# Altium schematic sheet Sheet1.SchDoc
size A2
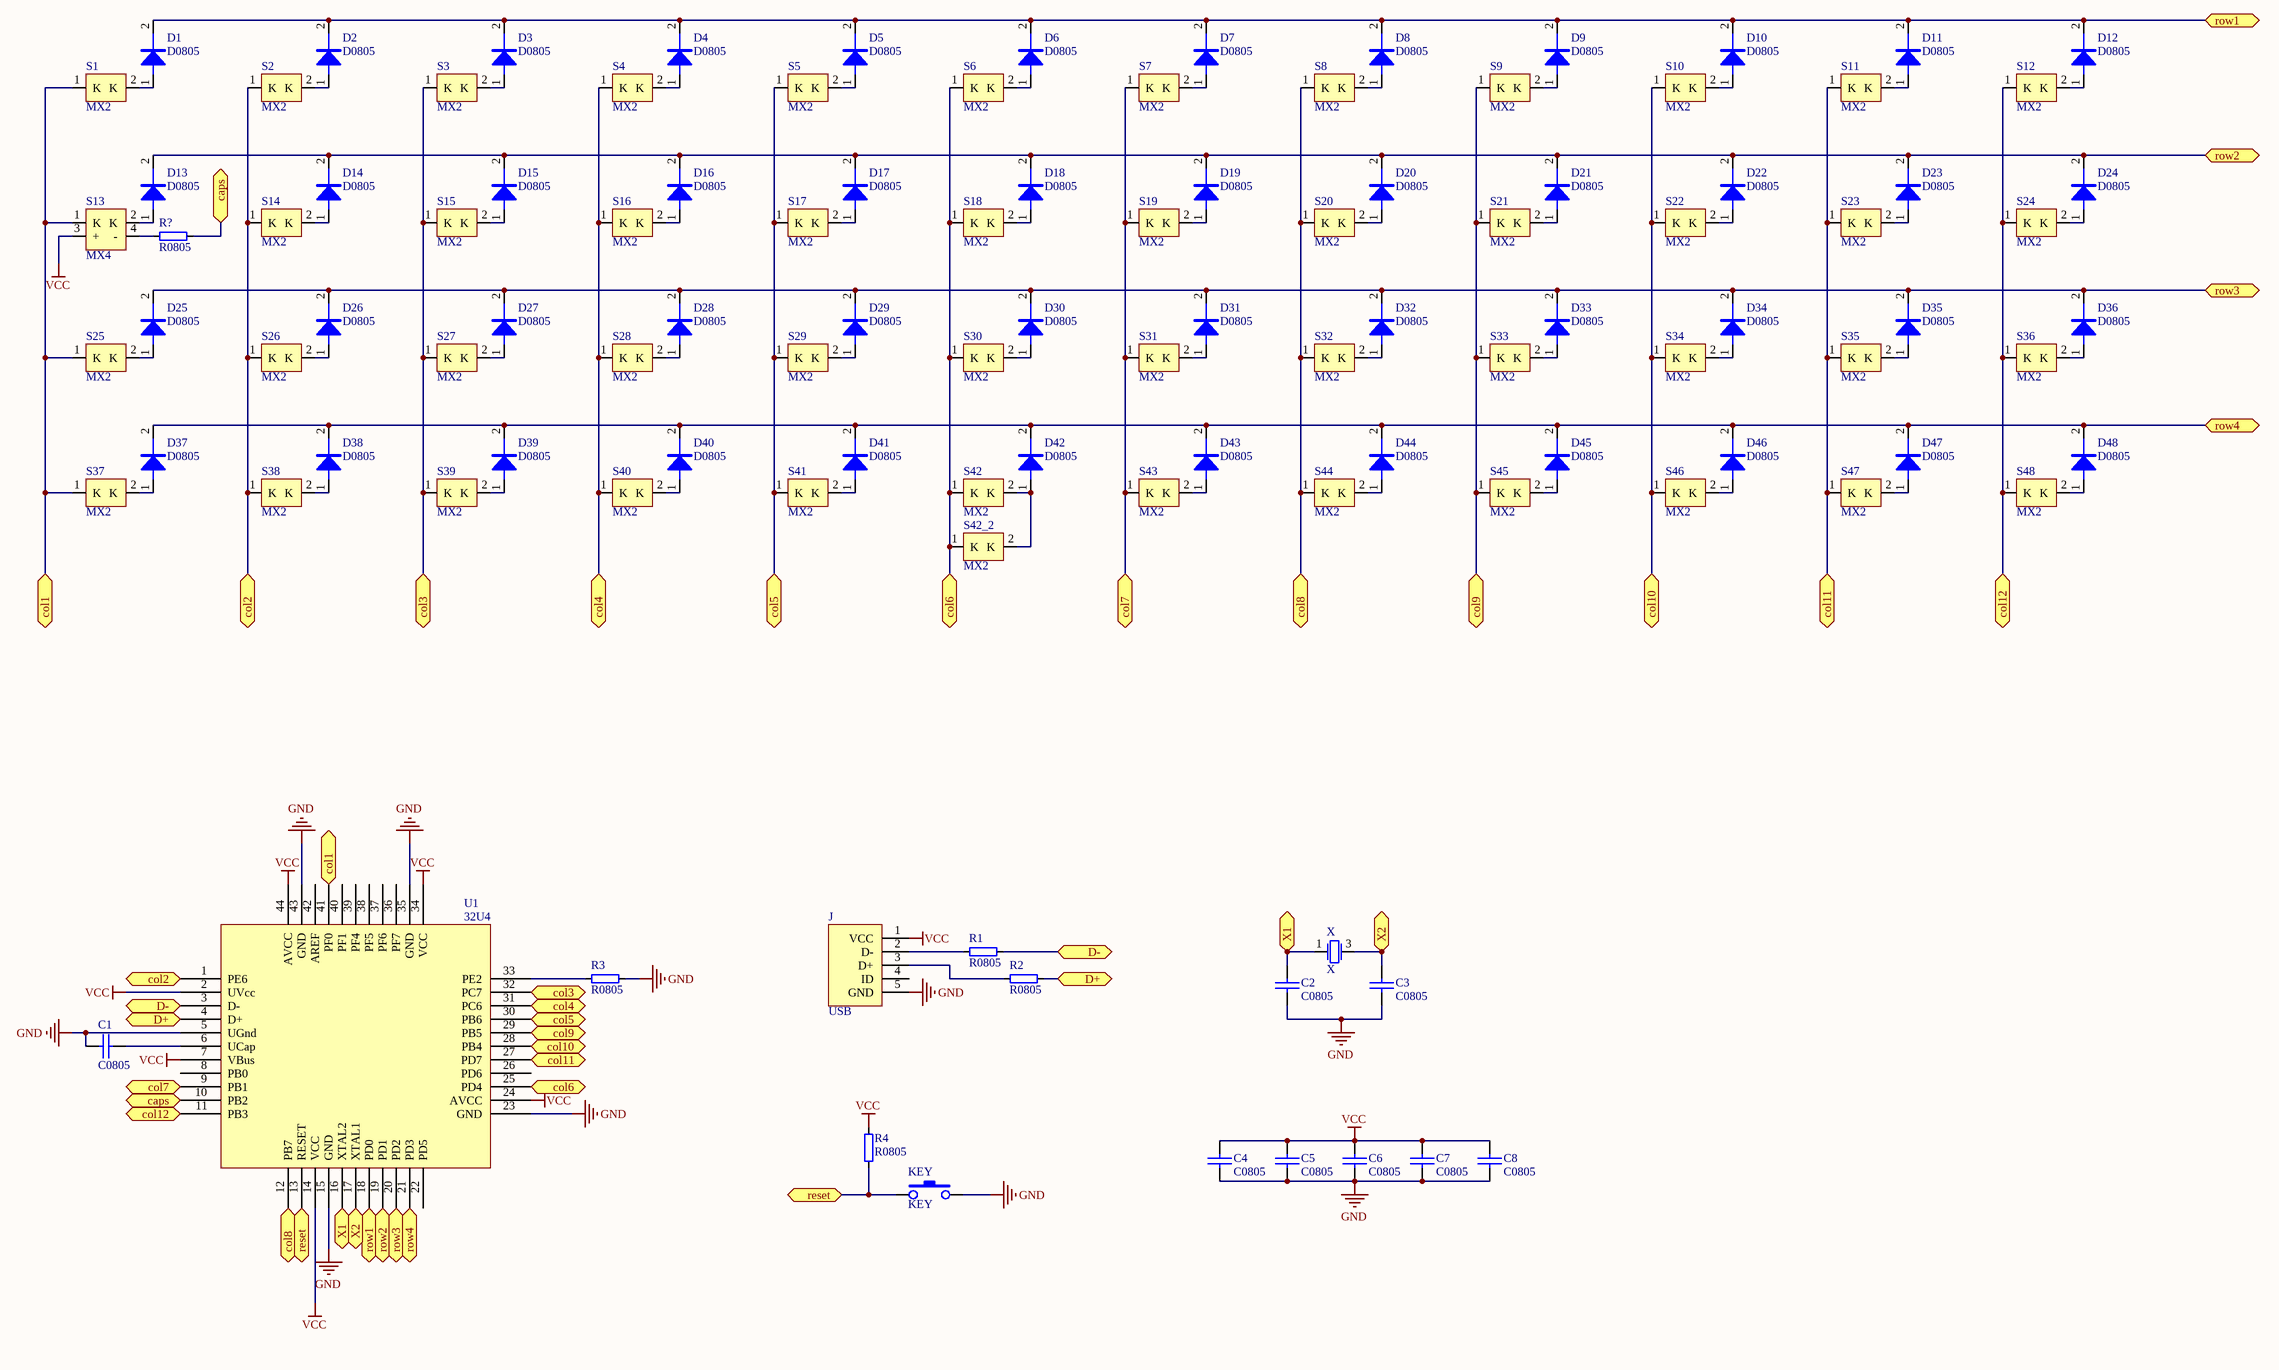
[diagram p0: Sheet1.SchDoc]

## Parts
C1  C0805  [C]
C2  C0805  [C]
C3  C0805  [C]
C4  C0805  [C]
C5  C0805  [C]
C6  C0805  [C]
C7  C0805  [C]
C8  C0805  [C]
D1  D0805  [D0805]
D2  D0805  [D0805]
D3  D0805  [D0805]
D4  D0805  [D0805]
D5  D0805  [D0805]
D6  D0805  [D0805]
D7  D0805  [D0805]
D8  D0805  [D0805]
D9  D0805  [D0805]
D10  D0805  [D0805]
D11  D0805  [D0805]
D12  D0805  [D0805]
D13  D0805  [D0805]
D14  D0805  [D0805]
D15  D0805  [D0805]
D16  D0805  [D0805]
D17  D0805  [D0805]
D18  D0805  [D0805]
D19  D0805  [D0805]
D20  D0805  [D0805]
D21  D0805  [D0805]
D22  D0805  [D0805]
D23  D0805  [D0805]
D24  D0805  [D0805]
D25  D0805  [D0805]
D26  D0805  [D0805]
D27  D0805  [D0805]
D28  D0805  [D0805]
D29  D0805  [D0805]
D30  D0805  [D0805]
D31  D0805  [D0805]
D32  D0805  [D0805]
D33  D0805  [D0805]
D34  D0805  [D0805]
D35  D0805  [D0805]
D36  D0805  [D0805]
D37  D0805  [D0805]
D38  D0805  [D0805]
D39  D0805  [D0805]
D40  D0805  [D0805]
D41  D0805  [D0805]
D42  D0805  [D0805]
D43  D0805  [D0805]
D44  D0805  [D0805]
D45  D0805  [D0805]
D46  D0805  [D0805]
D47  D0805  [D0805]
D48  D0805  [D0805]
J  USB  [USB]
KEY  KEY  [KEY]
R1  R0805  [R]
R2  R0805  [R]
R3  R0805  [R]
R4  R0805  [R]
R?  R0805  [R]
S1  MX2  [MX2]
S2  MX2  [MX2]
S3  MX2  [MX2]
S4  MX2  [MX2]
S5  MX2  [MX2]
S6  MX2  [MX2]
S7  MX2  [MX2]
S8  MX2  [MX2]
S9  MX2  [MX2]
S10  MX2  [MX2]
S11  MX2  [MX2]
S12  MX2  [MX2]
S13  MX4  [MX4]
S14  MX2  [MX2]
S15  MX2  [MX2]
S16  MX2  [MX2]
S17  MX2  [MX2]
S18  MX2  [MX2]
S19  MX2  [MX2]
S20  MX2  [MX2]
S21  MX2  [MX2]
S22  MX2  [MX2]
S23  MX2  [MX2]
S24  MX2  [MX2]
S25  MX2  [MX2]
S26  MX2  [MX2]
S27  MX2  [MX2]
S28  MX2  [MX2]
S29  MX2  [MX2]
S30  MX2  [MX2]
S31  MX2  [MX2]
S32  MX2  [MX2]
S33  MX2  [MX2]
S34  MX2  [MX2]
S35  MX2  [MX2]
S36  MX2  [MX2]
S37  MX2  [MX2]
S38  MX2  [MX2]
S39  MX2  [MX2]
S40  MX2  [MX2]
S41  MX2  [MX2]
S42  MX2  [MX2]
S42_2  MX2  [MX2]
S43  MX2  [MX2]
S44  MX2  [MX2]
S45  MX2  [MX2]
S46  MX2  [MX2]
S47  MX2  [MX2]
S48  MX2  [MX2]
U1  32U4  [32U4]
X  X  [X]

## Ports
caps, col1, col2, col3, col4, col5, col6, col7, col8, col9, col10, col11, col12, D+, D-, reset, row1, row2, row3, row4, X1, X2

## Nets
GND: C1.1 C2.2 C3.2 C4.2 C5.2 C6.2 C7.2 C8.2 J.5(GND) KEY.2 R3.2 U1.5(UGnd) U1.15(GND) U1.23(GND) U1.35(GND) U1.43(GND)
VCC: C4.1 C5.1 C6.1 C7.1 C8.1 J.1(VCC) R4.2 S13.3(+) U1.2(UVcc) U1.7(VBus) U1.14(VCC) U1.24(AVCC) U1.34(VCC) U1.44(AVCC)
caps: R?.2 U1.10(PB2) ; port caps
col1: S1.1(K) S13.1(K) S25.1(K) S37.1(K) U1.41(PF0) ; port col1
col2: S2.1(K) S14.1(K) S26.1(K) S38.1(K) U1.1(PE6) ; port col2
col3: S3.1(K) S15.1(K) S27.1(K) S39.1(K) U1.32(PC7) ; port col3
col4: S4.1(K) S16.1(K) S28.1(K) S40.1(K) U1.31(PC6) ; port col4
col5: S5.1(K) S17.1(K) S29.1(K) S41.1(K) U1.30(PB6) ; port col5
col6: S6.1(K) S18.1(K) S30.1(K) S42.1(K) S42_2.1(K) U1.25(PD4) ; port col6
col7: S7.1(K) S19.1(K) S31.1(K) S43.1(K) U1.9(PB1) ; port col7
col8: S8.1(K) S20.1(K) S32.1(K) S44.1(K) U1.12(PB7) ; port col8
col9: S9.1(K) S21.1(K) S33.1(K) S45.1(K) U1.29(PB5) ; port col9
col10: S10.1(K) S22.1(K) S34.1(K) S46.1(K) U1.28(PB4) ; port col10
col11: S11.1(K) S23.1(K) S35.1(K) S47.1(K) U1.27(PD7) ; port col11
col12: S12.1(K) S24.1(K) S36.1(K) S48.1(K) U1.11(PB3) ; port col12
D+: R2.2 U1.4(D+) ; port D+
D-: R1.2 U1.3(D-) ; port D-
reset: KEY.1 R4.1 U1.13(RESET) ; port reset
row1: D1.2 D2.2 D3.2 D4.2 D5.2 D6.2 D7.2 D8.2 D9.2 D10.2 D11.2 D12.2 U1.18(PD0) ; port row1
row2: D13.2 D14.2 D15.2 D16.2 D17.2 D18.2 D19.2 D20.2 D21.2 D22.2 D23.2 D24.2 U1.19(PD1) ; port row2
row3: D25.2 D26.2 D27.2 D28.2 D29.2 D30.2 D31.2 D32.2 D33.2 D34.2 D35.2 D36.2 U1.20(PD2) ; port row3
row4: D37.2 D38.2 D39.2 D40.2 D41.2 D42.2 D43.2 D44.2 D45.2 D46.2 D47.2 D48.2 U1.21(PD3) ; port row4
X1: C2.1 U1.16(XTAL2) X.1 ; port X1
X2: C3.1 U1.17(XTAL1) X.3 ; port X2
NetC1_2: C1.2 U1.6(UCap)
NetD1_1: D1.1 S1.2(K)
NetD2_1: D2.1 S2.2(K)
NetD3_1: D3.1 S3.2(K)
NetD4_1: D4.1 S4.2(K)
NetD5_1: D5.1 S5.2(K)
NetD6_1: D6.1 S6.2(K)
NetD7_1: D7.1 S7.2(K)
NetD8_1: D8.1 S8.2(K)
NetD9_1: D9.1 S9.2(K)
NetD10_1: D10.1 S10.2(K)
NetD11_1: D11.1 S11.2(K)
NetD12_1: D12.1 S12.2(K)
NetD13_1: D13.1 S13.2(K)
NetD14_1: D14.1 S14.2(K)
NetD15_1: D15.1 S15.2(K)
NetD16_1: D16.1 S16.2(K)
NetD17_1: D17.1 S17.2(K)
NetD18_1: D18.1 S18.2(K)
NetD19_1: D19.1 S19.2(K)
NetD20_1: D20.1 S20.2(K)
NetD21_1: D21.1 S21.2(K)
NetD22_1: D22.1 S22.2(K)
NetD23_1: D23.1 S23.2(K)
NetD24_1: D24.1 S24.2(K)
NetD25_1: D25.1 S25.2(K)
NetD26_1: D26.1 S26.2(K)
NetD27_1: D27.1 S27.2(K)
NetD28_1: D28.1 S28.2(K)
NetD29_1: D29.1 S29.2(K)
NetD30_1: D30.1 S30.2(K)
NetD31_1: D31.1 S31.2(K)
NetD32_1: D32.1 S32.2(K)
NetD33_1: D33.1 S33.2(K)
NetD34_1: D34.1 S34.2(K)
NetD35_1: D35.1 S35.2(K)
NetD36_1: D36.1 S36.2(K)
NetD37_1: D37.1 S37.2(K)
NetD38_1: D38.1 S38.2(K)
NetD39_1: D39.1 S39.2(K)
NetD40_1: D40.1 S40.2(K)
NetD41_1: D41.1 S41.2(K)
NetD42_1: D42.1 S42.2(K) S42_2.2(K)
NetD43_1: D43.1 S43.2(K)
NetD44_1: D44.1 S44.2(K)
NetD45_1: D45.1 S45.2(K)
NetD46_1: D46.1 S46.2(K)
NetD47_1: D47.1 S47.2(K)
NetD48_1: D48.1 S48.2(K)
NetJ_2: J.2(D-) R1.1
NetJ_3: J.3(D+) R2.1
NetR3_1: R3.1 U1.33(PE2)
NetR?_1: R?.1 S13.4(-)

Not connected (* = marked no-connect by the designer): J 4(ID); U1 8(PB0) 22(PD5) 26(PD6) 36(PF7) 37(PF6) 38(PF5) 39(PF4) 40(PF1) 42(AREF)